# EAGLE schematic 7segGates (EAGLE 6.6.0)
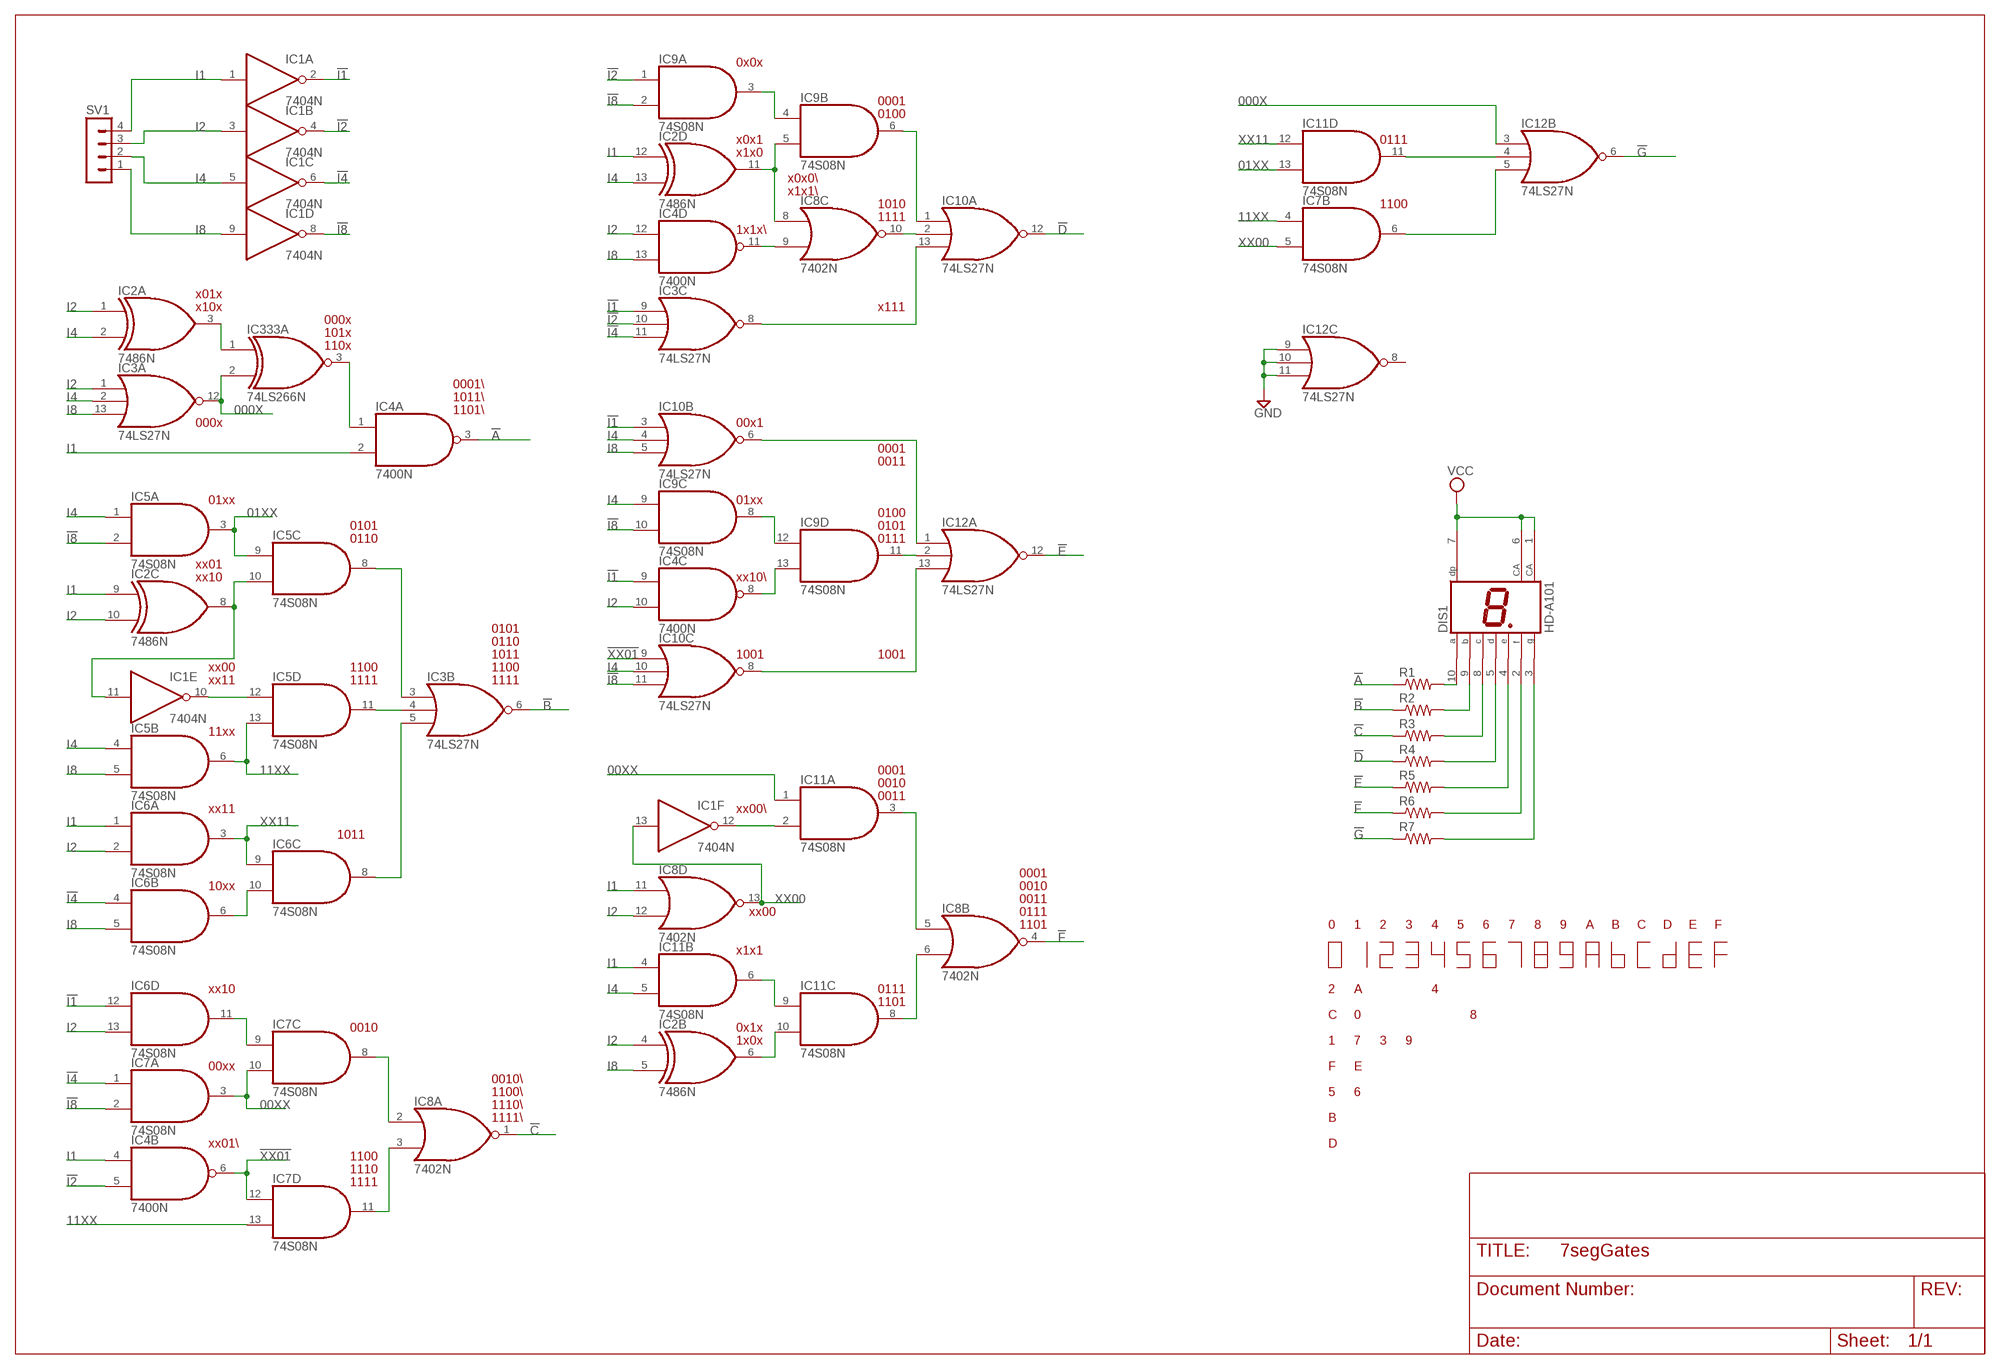
[diagram p0: schematic, sheet 1]

## Parts
DIS1  HD-A101  [HDSP-A]
IC1  7404N  [DIL14]
IC2  7486N  [DIL14]
IC3  74LS27N  [DIL14]
IC4  7400N  [DIL14]
IC5  74S08N  [DIL14]
IC6  74S08N  [DIL14]
IC7  74S08N  [DIL14]
IC8  7402N  [DIL14]
IC9  74S08N  [DIL14]
IC10  74LS27N  [DIL14]
IC11  74S08N  [DIL14]
IC12  74LS27N  [DIL14]
IC333  74LS266N  [DIL14]
R1  R-US_0207/10  [0207/10]
R2  R-US_0207/10  [0207/10]
R3  R-US_0207/10  [0207/10]
R4  R-US_0207/10  [0207/10]
R5  R-US_0207/10  [0207/10]
R6  R-US_0207/10  [0207/10]
R7  R-US_0207/10  [0207/10]
SV1  MA04-1  [MA04-1]

## Nets
000X: IC3.12(A:O) IC12.3(B:I0) IC333.2(A:I1)
00XX: IC7.3(A:O) IC7.10(C:I1) IC11.1(A:I0)
01XX: IC5.3(A:O) IC5.9(C:I0) IC11.13(D:I1)
10XX: IC6.6(B:O) IC6.10(C:I1)
11XX: IC5.6(B:O) IC5.13(D:I1) IC7.4(B:I0) IC7.13(D:I1)
!A: IC4.3(A:O) R1.1
!B: IC3.6(B:O) R2.1
!C: IC8.1(A:O) R3.1
!D: IC10.12(A:O) R4.1
!E: IC12.12(A:O) R5.1
!F: IC8.4(B:O) R6.1
!G: IC12.6(B:O) R7.1
!I1: IC1.2(A:O) IC3.9(C:I0) IC4.9(C:I0) IC6.12(D:I0) IC10.3(B:I0)
!I2: IC1.4(B:O) IC3.10(C:I1) IC4.5(B:I1) IC9.1(A:I0)
!I4: IC1.6(C:O) IC3.11(C:I2) IC6.4(B:I0) IC7.1(A:I0)
!I8: IC1.8(D:O) IC5.2(A:I1) IC7.2(A:I1) IC9.2(A:I1) IC9.10(C:I1) IC10.11(C:I2)
!XX01: IC4.6(B:O) IC7.12(D:I0) IC10.9(C:I0)
GND: IC12.9(C:I0) IC12.10(C:I1) IC12.11(C:I2)
I1: IC1.1(A:I) IC2.9(C:I0) IC2.12(D:I0) IC4.2(A:I1) IC4.4(B:I0) IC6.1(A:I0) IC8.11(D:I0) IC11.4(B:I0) SV1.4
I2: IC1.3(B:I) IC2.1(A:I0) IC2.4(B:I0) IC2.10(C:I1) IC3.1(A:I0) IC4.10(C:I1) IC4.12(D:I0) IC6.2(A:I1) IC6.13(D:I1) IC8.12(D:I1) SV1.3
I4: IC1.5(C:I) IC2.2(A:I1) IC2.13(D:I1) IC3.2(A:I1) IC5.1(A:I0) IC5.4(B:I0) IC9.9(C:I0) IC10.4(B:I1) IC10.10(C:I1) IC11.5(B:I1) SV1.2
I8: IC1.9(D:I) IC2.5(B:I1) IC3.13(A:I2) IC4.13(D:I1) IC5.5(B:I1) IC6.5(B:I1) IC10.5(B:I2) SV1.1
N$1: IC1.11(E:I) IC2.8(C:O) IC5.10(C:I1)
N$2: IC9.8(C:O) IC9.12(D:I0)
N$3: IC1.12(F:O) IC11.2(A:I1)
N$4: IC4.8(C:O) IC9.13(D:I1)
N$5: DIS1.10(A) R1.2
N$6: IC6.11(D:O) IC7.9(C:I0)
N$7: DIS1.9(B) R2.2
N$8: DIS1.8(C) R3.2
N$9: IC2.3(A:O) IC333.1(A:I0)
N$10: IC4.1(A:I0) IC333.3(A:O)
N$11: DIS1.5(D) R4.2
N$13: DIS1.4(E) R5.2
N$14: IC11.6(B:O) IC11.9(C:I0)
N$15: IC2.6(B:O) IC11.10(C:I1)
N$16: IC8.5(B:I0) IC11.3(A:O)
N$17: IC8.6(B:I1) IC11.8(C:O)
N$18: IC11.11(D:O) IC12.4(B:I1)
N$19: IC7.6(B:O) IC12.5(B:I2)
N$20: IC1.10(E:O) IC5.12(D:I0)
N$21: DIS1.2(F) R6.2
N$22: IC9.11(D:O) IC12.2(A:I1)
N$24: IC7.8(C:O) IC8.2(A:I0)
N$25: DIS1.3(G) R7.2
N$26: IC10.6(B:O) IC12.1(A:I0)
N$27: IC3.4(B:I1) IC5.11(D:O)
N$28: IC3.3(B:I0) IC5.8(C:O)
N$29: IC3.5(B:I2) IC6.8(C:O)
N$30: IC7.11(D:O) IC8.3(A:I1)
N$31: IC9.3(A:O) IC9.4(B:I0)
N$32: IC2.11(D:O) IC8.8(C:I0) IC9.5(B:I1)
N$34: IC4.11(D:O) IC8.9(C:I1)
N$35: IC8.10(C:O) IC10.2(A:I1)
N$36: IC9.6(B:O) IC10.1(A:I0)
N$37: IC3.8(C:O) IC10.13(A:I2)
N$38: IC10.8(C:O) IC12.13(A:I2)
VCC: DIS1.1(CA) DIS1.6(CA) DIS1.7(DP)
XX00: IC1.13(F:I) IC7.5(B:I1) IC8.13(D:O)
XX11: IC6.3(A:O) IC6.9(C:I0) IC11.12(D:I0)
Unconnected: IC12.8(C:O) IC333.4(B:O) IC333.5(B:I0) IC333.6(B:I1) IC333.8(C:I0) IC333.9(C:I1) IC333.10(C:O) IC333.11(D:O) IC333.12(D:I0) IC333.13(D:I1)

## Notes on the sheet
- 0x0x
- 0001
- 0100
- x0x1 | 0111
- x1x0
- x0x0\\
- x1x1\\
- 1010 | 1100
- 1111
- 1x1x\\
- x01x
- x10x | x111
- 000x
- 101x
- 110x
- 0001\\
- 1011\\
- 1101\\
- 000x | 00x1
- 0001
- 0011
- 01xx | 01xx
- 0100
- 0101 | 0101
- 0110 | 0111
- xx01
- xx10 | xx10\\
- 0101
- 0110
- 1011 | 1001 | 1001
- xx00 | 1100 | 1100
- xx11 | 1111 | 1111
- 11xx
- 0001
- 0010
- 0011
- xx11 | xx00\\
- 1011
- 0001
- 10xx | 0010
- 0011
- xx00 | 0111
- 1101 | 0 | 1 | 2 | 3 | 4 | 5 | 6 | 7 | 8 | 9 | A | B | C | D | E | F
- x1x1
- xx10 | 0111 | 2 | A | 4
- 1101
- C | 0 | 8
- 0010 | 0x1x
- 1x0x | 1 | 7 | 3 | 9
- 00xx | F | E
- 0010\\
- 1100\\ | 5 | 6
- 1110\\
- 1111\\ | B
- xx01\\ | D
- 1100
- 1110
- 1111

## Power pins joined to a net without a drawn wire
GND: IC1.7(P:GND) IC2.7(P:GND) IC3.7(P:GND) IC4.7(P:GND) IC5.7(P:GND) IC6.7(P:GND) IC7.7(P:GND) IC8.7(P:GND) IC9.7(P:GND) IC10.7(P:GND) IC11.7(P:GND) IC12.7(P:GND) IC333.7(P:GND)
VCC: IC1.14(P:VCC) IC2.14(P:VCC) IC3.14(P:VCC) IC4.14(P:VCC) IC5.14(P:VCC) IC6.14(P:VCC) IC7.14(P:VCC) IC8.14(P:VCC) IC9.14(P:VCC) IC10.14(P:VCC) IC11.14(P:VCC) IC12.14(P:VCC) IC333.14(P:VCC)

## Library data of the parts
DIS1 = display-hp:HD-A101: LED DISPLAY 1-character 7 segment, decimal point right; OC_FARNELL: unknown; OC_NEWARK: unknown
IC1 = 74xx-us:74*04: Hex INVERTER
IC2 = 74xx-us:74*86: Quad 2-input EXCLUSIV-OR (XOR) gate
IC3 IC10 IC12 = 74xx-us:74*27: Triple 3-input NOR gate
IC4 = 74xx-us:74*00: Quad 2-input NAND gate
IC5-IC7 IC9 IC11 = 74xx-us:74*08: Quad 2-input AND gate
IC8 = 74xx-us:74*02: Quad 2-input NOR gate
IC333 = 74xx-us:74*266: Quadruple EXCLUSIVE-NOR (XNOR), open-collector
R1-R7 = rcl:R-US_: RESISTOR, American symbol
SV1 = con-lstb:MA04-1: PIN HEADER; OC_FARNELL: unknown; OC_NEWARK: unknown